# Altium project Dravyasense.PrjPcb
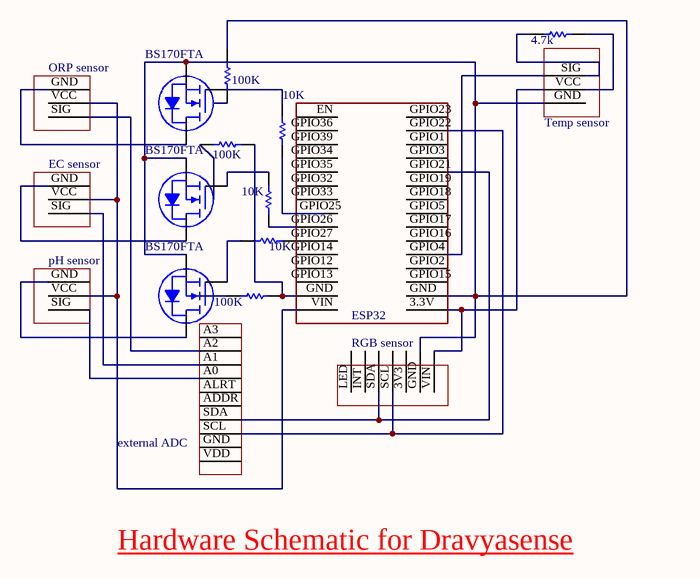
[diagram p0: Dravyasense.SchDoc]
1 sheet, 17 parts. Net scope: global (net labels, ports and power ports of the same name join across sheets).

## Sheet Dravyasense.SchDoc
size A4; SheetNumber: 1; SheetTotal: 1

### Parts
(Parts that share a designator on the sheet are numbered #1, #2 ... from top to bottom, then left to right.)
100K  value 100K  (hidden comment: Resistor)
*#1  Temp sensor
*#2  ORP sensor
*#3  EC sensor
*#4  RGB sensor
*#5  ESP32
*#6  external ADC
*?  pH sensor
?#1  value 100K  (hidden comment: Resistor)
?#2  value 100K  (hidden comment: Resistor)
I  BS170FTA  [DIODES SOT-23-3]
IC?#1  BS170FTA  [DIODES SOT-23-3]
IC?#2  BS170FTA  [DIODES SOT-23-3]
R?#1  value 4.7k  (hidden comment: Resistor)
R?#2  value 10K  (hidden comment: Resistor)
R?#3  value 10K  (hidden comment: Resistor)
R?#4  value 10K  (hidden comment: Resistor)

### Sub-sheets
Designator = File Name (file not in this document): no entries
Designator = File Name (file not in this document): no entries
Designator = File Name (file not in this document): no entries
Designator = File Name (file not in this document): no entries
Designator = File Name (file not in this document): no entries
Designator = File Name (file not in this document): no entries
Designator = File Name (file not in this document): no entries

### Nets
Net100K_2: 100K.2 *#5.GND ?#2.2
Net*#1_GND: *#1.GND *#4.GND *#5.GND ?#1.1 I.2(S) IC?#1.2(S) IC?#2.2(S)
Net*#1_SIG: *#1.SIG *#5.GPIO4
Net*#1_VCC: *#1.VCC *#4.VIN *#5.3.3V
Net*#2_VCC: *#2.VCC *#3.VCC *#5.VIN *?.VCC
Net*#5_GPIO21: *#5.GPIO21 *#6.SDA
Net*#5_GPIO22: *#5.GPIO22 *#6.SCL
Net*#5_GPIO26: *#5.GPIO26 R?#3.1
Net*#5_GPIO27: *#5.GPIO27 R?#4.2
NetI_1: I.1(G) R?#4.1
NetIC?#1_1: IC?#1.1(G) R?#2.2
NetIC?#2_1: IC?#2.1(G) R?#3.2

Not connected (* = marked no-connect by the designer): 100K 1; *#2 GND(42) SIG(44); *#3 GND(42) SIG(44); *#4 3V3 INT(43) LED(42) SCL(45) SDA(44); *#5 EN GPIO1(18) GPIO2(27) GPIO3(19) GPIO5 GPIO12(3) GPIO13(2) GPIO14(4) GPIO15(28) GPIO16(25) GPIO17(24) GPIO18(22) GPIO19(21) GPIO23(16) GPIO25(7) GPIO32(9) GPIO33(8) GPIO34(11) GPIO35(10) GPIO36 GPIO39; *#6 A0(38) A1(33) A2(41) A3(31) ADDR(39) ALRT(37) GND(36) VDD(35); *? GND(42) SIG(44); ?#1 2; ?#2 1; I 3(D); IC?#1 3(D); IC?#2 3(D); R?#1 1 2; R?#2 1

### Notes on the sheet
- Hardware Schematic for Dravyasense

### Library data of the parts
100K ?#1 ?#2 R?#1-R?#4 = Resistor: TC1: 0; SimulationGenericComponent: True; TC2: 0
*#1 *#2 *? = EC sensor
*#4 = TCS34725
*#5 = Component_1
*#6 = ADS1115
I IC?#1 IC?#2 = BS170FTA: MOSFET N-CH 60V 0.15MA SOT23-3; Manufacturer: Diodes Incorporated; Current - Continuous Drain (Id) @ 25°C: 150µA (Ta); Drive Voltage (Max Rds On,  Min Rds On): 10V; FET Type: N-Channel; Input Capacitance (Ciss) (Max) @ Vds: 60 pF @ 10 V; Power Dissipation (Max): 330mW (Ta); Rds On (Max) @ Id, Vgs: 5Ohm @ 200mA, 10V; Vgs (Max): ±20V; Vgs(th) (Max) @ Id: 3V @ 1mA; Part Number: BS170FTA; ComponentLink1Description: Datasheet; ComponentLink1URL: //media.digikey.com/pdf/Data%20Sheets/Zetex%20PDFs/BS170F.PDF; ComponentLink2Description: DigiKey Link; ComponentLink2URL: https://www.digikey.com/en/products/detail/diodes-incorporated/BS170FTA/53877; Drain to Source Voltage (Vdss): 60 V; LastUpdated: 03-06-2024 20:15:17; Lifecycle Status: Active; Minimum Order: 1; Mounting Type: Surface Mount; Operating Temperature: -55°C ~ 150°C (TJ); Package / Case: TO-236-3, SC-59, SOT-23-3; Packaging: TapeAndReel; Part Status: Active; Price: 0.22; Series: -; Supplier 1: DigiKey; Supplier Part Number 1: BS170FCT-ND; Supplier Device Package: SOT-23-3; Technology: MOSFET (Metal Oxide)